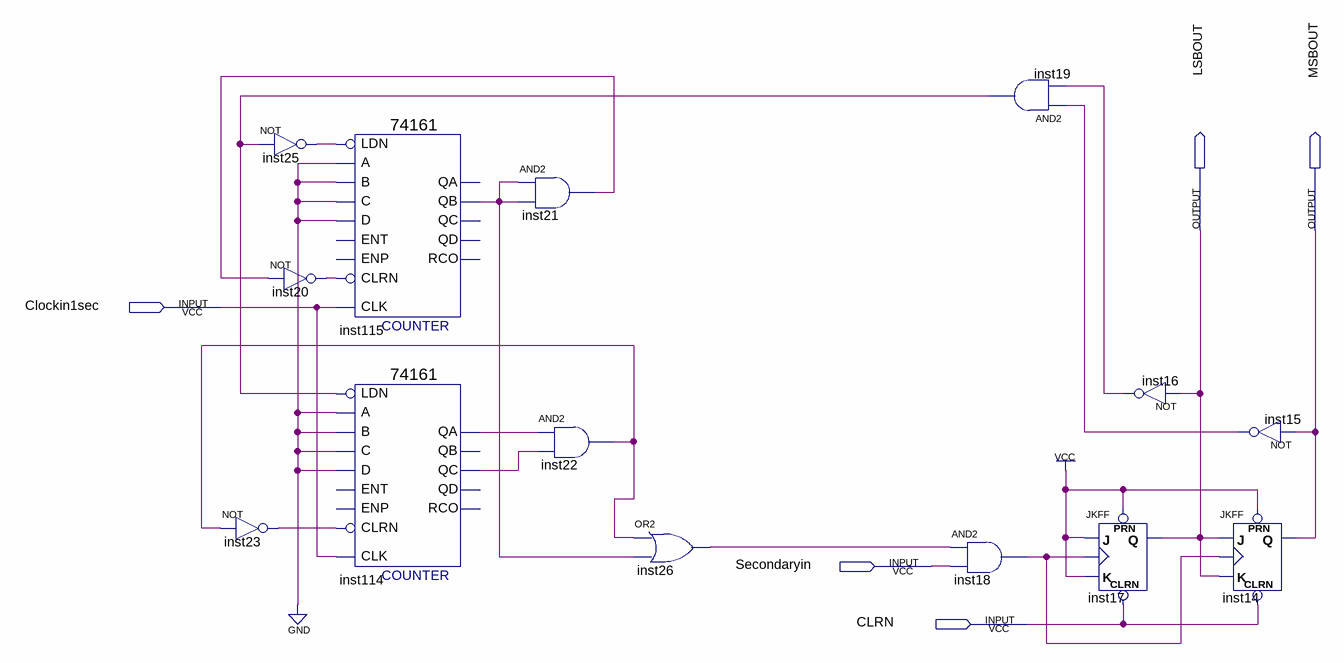
[diagram p0: schematic sheet]
// Quartus schematic MaquinadeStateSecondary.bdf as structural Verilog: 14 symbols, 5 pins
module MaquinadeStateSecondary (
  input  Clockin1sec,
  input  Secondaryin,
  input  CLRN,
  output LSBOUT,
  output MSBOUT
);

  wire inst15_out, inst16_out, inst18_out, inst19_out, inst20_out, inst21_out, inst22_out, inst23_out,
       inst25_out, inst26_out, inst114_qa, inst114_qc, inst115_qb;

  not inst25 (inst25_out, inst19_out);
  not inst20 (inst20_out, inst21_out);
  not inst23 (inst23_out, inst22_out);
  \74161  inst115 (
    .CLRN(inst20_out), .CLK(Clockin1sec), .LDN(inst25_out), .A(1'b0), .D(1'b0), .B(1'b0), .C(1'b0),
    .QB(inst115_qb));  // open: ENP, ENT, QD, QC, QA, RCO
  \74161  inst114 (
    .CLRN(inst23_out), .CLK(Clockin1sec), .LDN(inst19_out), .A(1'b0), .D(1'b0), .B(1'b0), .C(1'b0),
    .QC(inst114_qc), .QA(inst114_qa));  // open: ENP, ENT, QD, QB, RCO
  and inst21 (inst21_out, inst115_qb, inst115_qb);
  and inst22 (inst22_out, inst114_qa, inst114_qc);
  or inst26 (inst26_out, inst22_out, inst115_qb);
  and inst18 (inst18_out, inst26_out, Secondaryin);
  and inst19 (inst19_out, inst15_out, inst16_out);
  not inst16 (inst16_out, LSBOUT);
  JKFF inst17 (.PRN(1'b1), .CLRN(CLRN), .K(1'b1), .J(1'b1), .CLK(inst18_out), .Q(LSBOUT));
  not inst15 (inst15_out, MSBOUT);
  JKFF inst14 (.PRN(1'b1), .CLRN(CLRN), .K(LSBOUT), .J(LSBOUT), .CLK(inst18_out), .Q(MSBOUT));
endmodule
